# Altium schematic sheet Miscellaneous.SchDoc: <Project Name>
size A3; ApprovedBy: <Appr.>; Author: <Author>; CompanyName: Infineon Technologies AG; Engineer: <Rel.>; Organization: Infineon Technologies AG; Address1: IFAG DES S PS; Address2: Am Campeon 1-12  -  85579 Neubiberg  -  Germany; Address3: 85579 Neubiberg; Address4: Germany; DocumentNumber: 9; Revision: <Rev.>; SheetNumber: 9; SheetTotal: 9; Release: RC00; PageSetup: Record=PageOptions|CenterHorizontal=True|CenterVertical=True|PrintScale=1.01|XCorrection=1.00|YCorrection=1.00|PrintKind=0|BorderSize=5000000|LeftOffset=0|BottomOffset=0|Orientation=2|PaperLength=1000|PaperWidth=1000|Scale=100|PaperSource=7|PrintQuality=-4|MediaType=1|DitherType=10|PaperKind=A3|PrintScaleMode=1; Doc_ConfidentialStatus: <Doc_ConfidentialStatus>; Doc_Preliminary: <Doc_Preliminary>
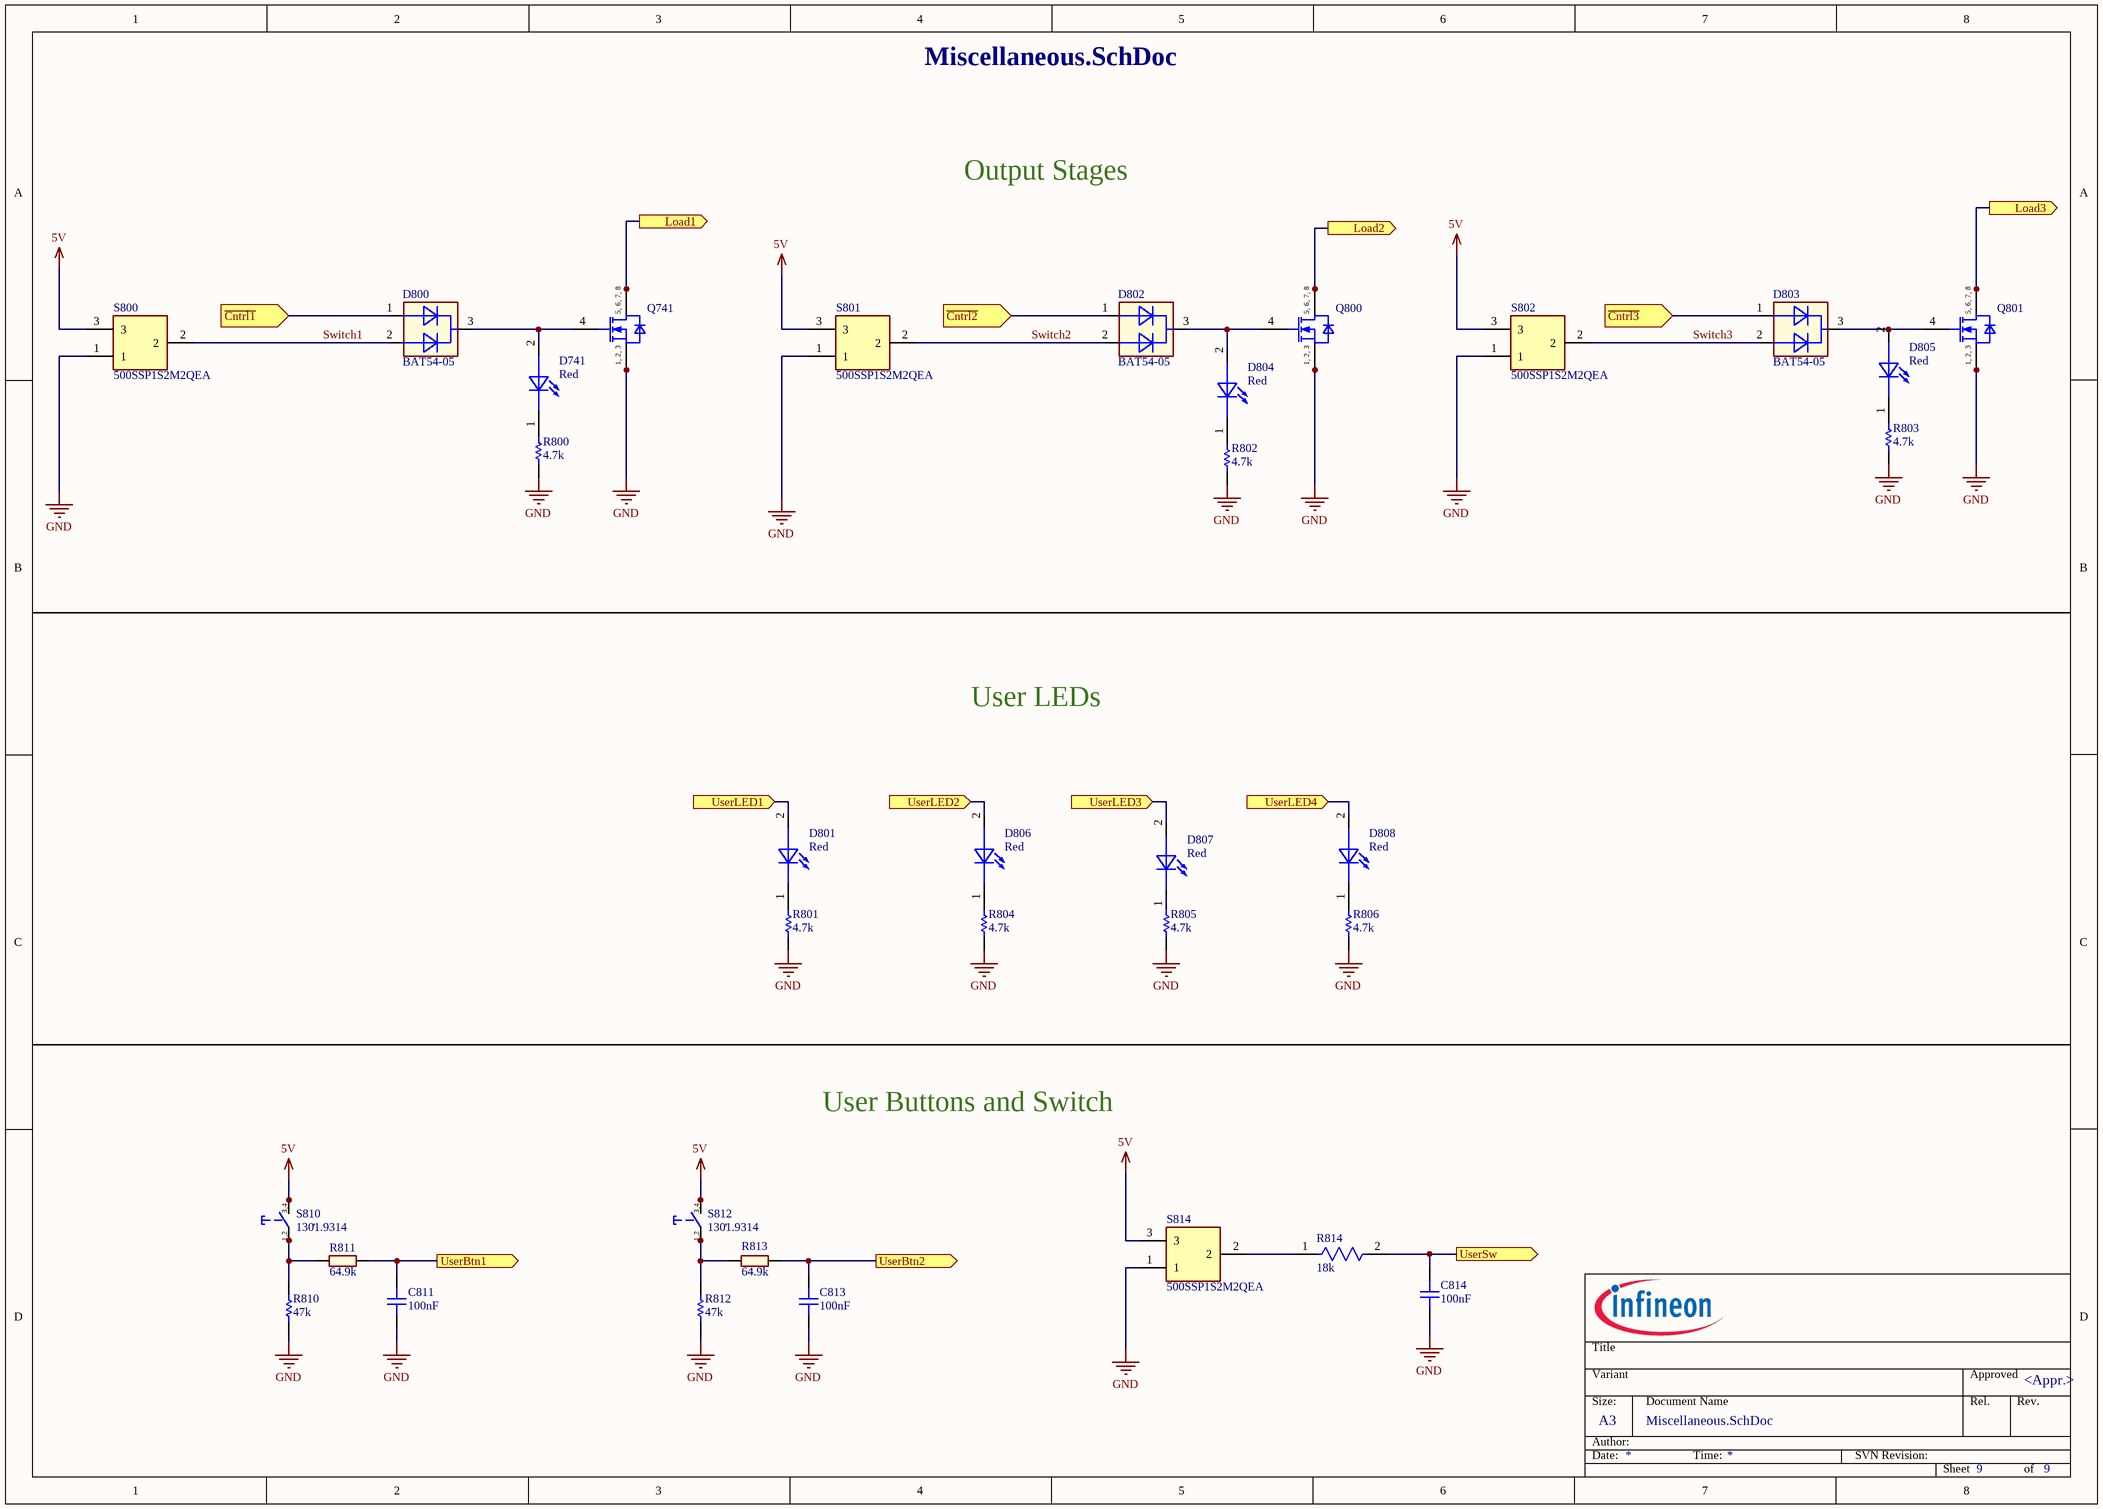
[diagram p0: Miscellaneous.SchDoc]

## Parts
C811  100nF  [CAPC3216X125N-0]
C813  100nF  [CAPC3216X125N-0]
C814  100nF  [CAPC3216X125N-0]
D741  Red  [LEDSC160X80X80-2N-1]
D800  BAT54-05  [SOT95P240X110-3N-1-V]
D801  Red  [LEDSC160X80X80-2N-1]
D802  BAT54-05  [SOT95P240X110-3N-1-V]
D803  BAT54-05  [SOT95P240X110-3N-1-V]
D804  Red  [LEDSC160X80X80-2N-1]
D805  Red  [LEDSC160X80X80-2N-1]
D806  Red  [LEDSC160X80X80-2N-1]
D807  Red  [LEDSC160X80X80-2N-1]
D808  Red  [LEDSC160X80X80-2N-1]
Q741  igfet_n_ch_enh_dio_1s2s3s4g5d6d7d8d_8p  [IFX-PG-TDSON-8-6-V]  (value not drawn)
Q800  igfet_n_ch_enh_dio_1s2s3s4g5d6d7d8d_8p  [IFX-PG-TDSON-8-6-V]  (value not drawn)
Q801  igfet_n_ch_enh_dio_1s2s3s4g5d6d7d8d_8p  [IFX-PG-TDSON-8-6-V]  (value not drawn)
R800  4.7k  [RESC3216X60X45ML15T20]
R801  4.7k  [RESC3216X60X45ML15T20]
R802  4.7k  [RESC3216X60X45ML15T20]
R803  4.7k  [RESC3216X60X45ML15T20]
R804  4.7k  [RESC3216X60X45ML15T20]
R805  4.7k  [RESC3216X60X45ML15T20]
R806  4.7k  [RESC3216X60X45ML15T20]
R810  47k  [RESC3216X60X45LL10T20]
R811  64.9k  [RESC3216X60N]
R812  47k  [RESC3216X60X45LL10T20]
R813  64.9k  [RESC3216X60N]
R814  18k  [FP-CRCW1206-e3-IPC_C]
S800  500SSP1S2M2QEA  [500SSP1S2M2QEA]
S801  500SSP1S2M2QEA  [500SSP1S2M2QEA]
S802  500SSP1S2M2QEA  [500SSP1S2M2QEA]
S810  1301.9314  [SW-SMD-1301.9314]
S812  1301.9314  [SW-SMD-1301.9314]
S814  500SSP1S2M2QEA  [500SSP1S2M2QEA]

## Ports
Load1 (out), Load2 (out), Load3 (out), UserBtn1 (out), UserBtn2 (out), UserLED1 (in), UserLED2 (in), UserLED3 (in), UserLED4 (in), UserSw (out), ~{Cntrl1} (in), ~{Cntrl2} (in), ~{Cntrl3} (in)

## Nets
5V: S800.3 S801.3 S802.3 S810.3 S810.4 S812.3 S812.4 S814.3
GND: C811.1 C813.1 C814.1 Q741.1(SOURCE) Q741.2(SOURCE) Q741.3(SOURCE) Q800.1(SOURCE) Q800.2(SOURCE) Q800.3(SOURCE) Q801.1(SOURCE) Q801.2(SOURCE) Q801.3(SOURCE) R800.1 R801.1 R802.1 R803.1 R804.1 R805.1 R806.1 R810.1 R812.1 S800.1 S801.1 S802.1 S814.1
~{Cntrl1}: D800.1(ANODE_1) ; port ~{Cntrl1}
~{Cntrl2}: D802.1(ANODE_1) ; port ~{Cntrl2}
~{Cntrl3}: D803.1(ANODE_1) ; port ~{Cntrl3}
Load1: Q741.5(DRAIN) Q741.6(DRAIN) Q741.7(DRAIN) Q741.8(DRAIN) ; port Load1
Load2: Q800.5(DRAIN) Q800.6(DRAIN) Q800.7(DRAIN) Q800.8(DRAIN) ; port Load2
Load3: Q801.5(DRAIN) Q801.6(DRAIN) Q801.7(DRAIN) Q801.8(DRAIN) ; port Load3
Switch1: D800.2(ANODE_2) S800.2
Switch2: D802.2(ANODE_2) S801.2
Switch3: D803.2(ANODE_2) S802.2
UserBtn1: C811.2 R811.2 ; port UserBtn1
UserBtn2: C813.2 R813.2 ; port UserBtn2
UserLED1: D801.2(Anode) ; port UserLED1
UserLED2: D806.2(Anode) ; port UserLED2
UserLED3: D807.2(Anode) ; port UserLED3
UserLED4: D808.2(Anode) ; port UserLED4
UserSw: C814.2 R814.2 ; port UserSw
NetD741_1: D741.1(Cathode) R800.2
NetD741_2: D741.2(Anode) D800.3(CATHODE) Q741.4(GATE)
NetD801_1: D801.1(Cathode) R801.2
NetD802_3: D802.3(CATHODE) D804.2(Anode) Q800.4(GATE)
NetD803_3: D803.3(CATHODE) D805.2(Anode) Q801.4(GATE)
NetD804_1: D804.1(Cathode) R802.2
NetD805_1: D805.1(Cathode) R803.2
NetD806_1: D806.1(Cathode) R804.2
NetD807_1: D807.1(Cathode) R805.2
NetD808_1: D808.1(Cathode) R806.2
NetR810_2: R810.2 R811.1 S810.1 S810.2
NetR812_2: R812.2 R813.1 S812.1 S812.2
NetR814_1: R814.1 S814.2

## Notes on the sheet
- Output Stages
- User LEDs
- User Buttons and Switch
- ,
- Title
- Variant
- Approved
- Date:
- Author:
- Size:
- A3
- Document Name
- Time:
- SVN Revision:
- Rel.
- Rev.
- Sheet
- of
- (in symbol 380147) 3,4; 1,2
- (in symbol 691273) 5, 6, 7, 8; 1, 2, 3

## Library data of the parts
C811 C813 C814 = 282874: CAP / CERA / 100nF / 50V / 10% / X7R (EIA) / -55°C to 125°C / 1206(3216) / SMD / -; Multiple Parts: No; Legacy PartNumber: CAP01005660; Manufacturer: MuRata; Manufacturer Order Number: GRM31MR71H104KA01; Symbol Type: Capacitor; Single; Standard; 2 Pins; Alternate View: Yes; Article Number: 282874; Version Number: V01; Combined Parameters: TC:X7R (EIA);Tol.:-10%/+10%;Vdc:50V; QuickPick: 100nF / 50V / 10% / X7R (EIA) / 1206 (3216); Type: Standard; Style: Single; Package Metric: 3216; Package Imperial: 1206; ComponentStatus: Released; PLMStatus: Obsolete; Legacy DeviceID: CAP01005660; Part Type: Capacitor; Value: 100nF; Tolerance Neg: 10%; Tolerance Pos: 10%; Application: Standard; Technology: Ceramic; Temperature min: -55; Temperature max: 125; Temperature Range: Military; ROHS Compliant: Y; Automotive Qualified: No; PackageReference: 1206 (3216); ComponentLink1Description: Vendor WebSite; ComponentLink1URL: http://www.murata.com/; ComponentLink2Description: Datasheet; ComponentLink2URL: http://webnetprod.muc.infineon.com/PCBPortal_Prod/WorkFlows/AltiumComponent/StandardDocumentation?Versionid=282875; Supplier 1: Farnell; Supplier 2: DigiKey; Supplier 3: Mouser; Second Source allowed: Yes; Voltage DC (max): 50V; Package Description: Capacitor,non-polarized,Chip;3.20mm L X 1.60mm W X 1.25mm H
D741 D801 D804-D808 = 625459: WL-SMCW SMT Mono-color Chip LED Waterclear, Red,630nm; Manufacturer: Wurth Elektronik; Manufacturer Order Number: 150060RS75000; Symbol Type: Standard LED Symbol, 1 Cathode, 2 Anode; Article Number: 625459; Version Number: V01; Combined Parameters: Vf:2.4V;If:30mA;Ur:5V;Ir:10uA;Pmax:72mW; QuickPick: LED / 1608 (0603); Style: Single; Automotive Qualified: No; ComponentStatus: Released; PLMStatus: Active; Second Source allowed: Yes; Voltage DC (max): na; Part Type: Diode; Value: Red; Type: LED; Application: Standard; Temperature min: -40; Temperature max: 85; Temperature Range: Industrial; ROHS Compliant: Y; PackageReference: 1608 (0603); ComponentLink1Description: Vendor WebSite; ComponentLink1URL: http://www.we-online.com; ComponentLink2Description: Datasheet; ComponentLink2URL: http://webnetprod.muc.infineon.com/PCBPortal_Prod/WorkFlows/AltiumComponent/StandardDocumentation?Versionid=625460; Supplier 1: Farnell; Supplier Part Number 1: 2322071; Supplier 2: DigiKey; Supplier Part Number 2: 732-4978-1-ND; Supplier 3: Mouser; Supplier Part Number 3: 710-150060RS75000; Package Description: LED,Side Concave; 2 pin,1.60mm W X 0.80mm L X 0.80mm H
D800 D802 D803 = 430837: Silicon Schottky Diode, LS(nH) 1.8, VR 30V; Legacy PartNumber: IFX01401370; Manufacturer: Infineon Technologies; Symbol type: Dual Diode Symbol 3 Pins, 1 Anode, 2 Anode, 3 Cathode; Article Number: 430837; Version Number: V01; Combined Parameters: Vf:800mV;If:200mA;Ur:30V;Ir:2uA;Pmax:230mW; QuickPick: Schottky Diode / PG-SOT23-3-11; Style: Dual; Automotive Qualified: AEC Q101; ComponentStatus: Released; PLMStatus: Active; Second Source allowed: Yes; Voltage DC (max): na; Legacy DeviceID: IFX01401370; Part Type: Diode; Manufacturer Order Number: BAT54-05; Value: BAT54-05; Type: Schottky Diode; Application: Standard; Temperature min: 0; Temperature max: 150; Temperature Range: Military; ROHS Compliant: Y; PackageReference: PG-SOT23-3-11; ComponentLink1Description: Vendor WebSite; ComponentLink1URL: https://www.infineon.com/; ComponentLink2Description: Datasheet; ComponentLink2URL: http://webnetprod.muc.infineon.com/PCBPortal_Prod/WorkFlows/AltiumComponent/StandardDocumentation?Versionid=430838; Supplier 1: Farnell; Supplier Part Number 1: 2725759; Supplier 2: DigiKey; Supplier Part Number 2: BAT5405E6327HTSA1TR-ND; Supplier 3: Mouser; Supplier Part Number 3: 726-BAT5405E6327HTSA; Package Description: SOT,0.95mm pitch;3 pin,1.30mm W X 2.90mm L X 1.10mm H body
Q741 = 691273: OptiMOS Power MOSFET, 30V; Manufacturer: Infineon Technologies; Manufacturer Order Number: BSC0906NS; MPN: BSC0906NSATMA1; Symbol Type: Insulated-Gate Field-Effect Transistor (IGFET), N-Channel, Enhancement, Body Diode, Pin 1 Source, 2 Source, 3 Source, 4 Gate, 5 Drain, 6 Drain, 7 Drain, 8 Drain, 8 Pins; Article Number: 691273; Version Number: V00; Legacy DeviceID: IFX_BSC0906NS; Value: BSC0906NS; Combined Parameters: N-Channel Enhancement;Uds:30V;Id:63A;Rds:4.5R;P:30W; QuickPick: N-Channel Enhancement / 30W / 63A / 30V / TDSON-8; Type: N-Channel Enhancement; Style: Single; Automotive Qualified: No; ComponentStatus: Released; PLMStatus: Active; Second Source allowed: Yes; Voltage DC (max): na; Part Type: Transistor FET; Application: Power Electronics; Temperature min: -55; Temperature max: 150; Temperature Range: Military; ROHS Compliant: Y; PackageReference: TDSON-8; ComponentLink1Description: Vendor WebSite; ComponentLink1URL: https://www.infineon.com/; ComponentLink2Description: Datasheet; ComponentLink2URL: http://webnetprod.muc.infineon.com/PCBPortal_Prod/WorkFlows/AltiumComponent/StandardDocumentation?Versionid=691274; Supplier 1: Farnell; Supplier Part Number 1: 2480745; Supplier 2: DigiKey; Supplier Part Number 2: BSC0906NSATMA1CT-ND; Supplier 3: Mouser; Supplier Part Number 3: 726-BSC0906NS; Package Description: PG-TDSON-8-6, SMD, 1.27 mm pitch, 8 pin, 5.90 mm W X 5.075 mm L X 1.20 mm H body
Q800 Q801 = 691273: OptiMOS Power MOSFET, 30V; Manufacturer: Infineon Technologies; Manufacturer Order Number: BSC0906NS; Symbol Type: Insulated-Gate Field-Effect Transistor (IGFET), N-Channel, Enhancement, Body Diode, Pin 1 Source, 2 Source, 3 Source, 4 Gate, 5 Drain, 6 Drain, 7 Drain, 8 Drain, 8 Pins; Article Number: 691273; Version Number: V00; Legacy DeviceID: IFX_BSC0906NS; Value: BSC0906NS; Combined Parameters: N-Channel Enhancement;Uds:30V;Id:63A;Rds:4.5R;P:30W; QuickPick: N-Channel Enhancement / 30W / 63A / 30V / TDSON-8; Type: N-Channel Enhancement; Style: Single; Automotive Qualified: No; ComponentStatus: Released; PLMStatus: Active; Second Source allowed: Yes; Voltage DC (max): na; Part Type: Transistor FET; Application: Power Electronics; Temperature min: -55; Temperature max: 150; Temperature Range: Military; ROHS Compliant: Y; PackageReference: TDSON-8; ComponentLink1Description: Vendor WebSite; ComponentLink1URL: https://www.infineon.com/; ComponentLink2Description: Datasheet; ComponentLink2URL: http://webnetprod.muc.infineon.com/PCBPortal_Prod/WorkFlows/AltiumComponent/StandardDocumentation?Versionid=691274; Supplier 1: Farnell; Supplier Part Number 1: 2480745; Supplier 2: DigiKey; Supplier Part Number 2: BSC0906NSATMA1CT-ND; Supplier 3: Mouser; Supplier Part Number 3: 726-BSC0906NS; Package Description: PG-TDSON-8-6, SMD, 1.27 mm pitch, 8 pin, 5.90 mm W X 5.075 mm L X 1.20 mm H body
R800-R806 = CMP-2100-03618-1: Chip Resistor, 4.7 KOhm, +/- 1%, 0.25 W, -55 to 155 degC, 1206 (3216 Metric), RoHS, Tape and Reel; Manufacturer: Vishay Semiconductor; Power Rating: 250mW; Voltage Rating: 200V; Temperature Coefficient: 100ppm/degreesC; Package Quantity: 10; Composition: ThickFilm; REACH SVHC: Unknown; Mount: SurfaceMount; Max Operating Temperature: 155degC; Length: 3.2mm; Number of Terminations: 2; Case Code (Metric): 3216; Military Standard: Not; Width: 1.6mm; Datasheet Version: 41061.0; Max Power Dissipation: 250mW; Datasheet URL: http://www.vishay.com/docs/20035/dcrcwe3.pdf; Contact Plating: Tin; Case/Package: 1206; Height: 0.55mm; Package Reference: 1206.0; Lead Free: LeadFree; Weight: 0.000353oz; Package Description: 2-Pin Surface Mount Device, Body 3.15 x 1.6 mm; Min Operating Temperature: -55degC; Value: 4.7KOhm; Packaging: TapeandReel; Depth: 1.6mm; Tolerance: 1%; RoHSCompliant: true; Termination: SMD/SMT; Case Code (Imperial): 1206; Voltage Rating (DC): 200V; Radiation Hardening: No; Manufacturer URL: http://www.vishay.com/
R810 R812 = CMP-2003-02213-1: Part Number: CRCW120647K0FKEA; Manufacturer: Vishay Dale; Value: 47k
R811 R813 = 354647: RES / STD / 64.9k / 250mW / 1% / 100ppm/K / -55°C to 155°C / 1206(3216) / SMD / -; Multiple Parts: No; Legacy PartNumber: RES01802950; Manufacturer: Vishay; Manufacturer Order Number: CRCW120664K9FK; Symbol Type: Resistor; Single; Standard; 2 Pins; Alternate View: Yes; Article Number: 354647; Version Number: V01; Combined Parameters: TCR:100ppm/K;Tol.:-1%/+1%;Vdc:200V;Idc:-;P:250mW; QuickPick: 64.9k / 1% / 0.25 / 1206 (3216); Style: Single; Automotive Qualified: AEC Q200; Package Metric: 3216; Package Imperial: 1206; ComponentStatus: Released; PLMStatus: Active; Voltage DC (max): 200V; Legacy DeviceID: RES01802950; Part Type: Resistor; Value: 64.9k; Tolerance Neg: 1%; Tolerance Pos: 1%; Type: Standard; Technology: Thick Film; Temperature min: -55; Temperature max: 155; Temperature Range: Military; ROHS Compliant: Y; PackageReference: 1206 (3216); ComponentLink1Description: Vendor WebSite; ComponentLink1URL: http://www.vishay.com; ComponentLink2Description: Datasheet; ComponentLink2URL: http://webnetprod.muc.infineon.com/PCBPortal_Prod/WorkFlows/AltiumComponent/StandardDocumentation?Versionid=354648; Supplier 1: Farnell; Supplier 2: DigiKey; Supplier 3: Mouser; Second Source allowed: Yes
R814 = CMP-2003-01854-2: RES Thick Film, 18kΩ, 1%, 0.25W, 100ppm/°C, 1206; Max Power Dissipation: 250mW; Voltage Rating: 200V; Resistance: 18kR; Radiation Hardening: No; Case Code (Imperial): 1206; Case/Package: 1206; Lead Free: Lead Free; Number of Terminations: 2; Case Code (Metric): 3216; Number of Pins: 2; Power Rating: 250mW; Length: 3.2mm; Width: 0.063inch; Features: Automotive AEC-Q200; Max Operating Temperature: 155°C; Tolerance: 1%; Termination: SMD/SMT; Military Standard: Not; Composition: Thick Film; Min Operating Temperature: -55°C; Temperature Coefficient: 100ppm/°C; Package Quantity: 10; Weight: 0.000353oz; Voltage Rating (DC): 200V; Depth: 1.6mm; Contact Plating: Tin; Height: 0.55mm; Packaging: Tape and Reel; Value: 18k
S800-S802 S814 = 500SSP1S2M2QEA: Connector; Manufacturer_Name: E-Switch; Datasheet Link: https://configured-product-images.s3.amazonaws.com/2D/specs/500SSP1S2M2QEA.pdf; Height: 6.6mm; Manufacturer_Part_Number: 500SSP1S2M2QEA; Mouser Part Number: 612-500SSP1S2M2QEA; Mouser Price/Stock: https://www.mouser.co.uk/ProductDetail/E-Switch/500SSP1S2M2QEA?qs=f57gQzlyLipU%252BL4xPBemOw%3D%3D; Value: 500SSP1S2M2QEA
S810 S812 = 380147: Pushbutton Tactile Switch, Single Pole Single Throw, 4 Pins; Legacy PartNumber: CON01500305; Manufacturer: Schurter; Symbol type: Tactile Switch, Spring Return, Single Pole Single Throw - Normally Open, 4 Pins; Article Number: 380147; Version Number: V01; Legacy DeviceID: SCH_1301.9314; ComponentStatus: Released; PLMStatus: Active; Second Source allowed: Yes; Voltage DC (max): na; Part Type: Electro Mechanic; Manufacturer Order Number: 1301.9314; Value: 1301.9314; Temperature min: -20; Temperature max: 70; Temperature Range: Commercial; ROHS Compliant: Y; ComponentLink1Description: Vendor WebSite; ComponentLink1URL: http://www.schurter.com.sg/; ComponentLink2Description: Datasheet; ComponentLink2URL: http://webnetprod.muc.infineon.com/PCBPortal_Prod/WorkFlows/AltiumComponent/StandardDocumentation?Versionid=380148; Supplier 1: Farnell; Supplier Part Number 1: 1217763; Supplier 2: DigiKey; Supplier Part Number 2: 1301.9314-ND; Supplier 3: Mouser; Supplier Part Number 3: 693-1301.9314; Package Description: SMD Switch, 6.00mm L X 6.00mm W X 4.3mm H body